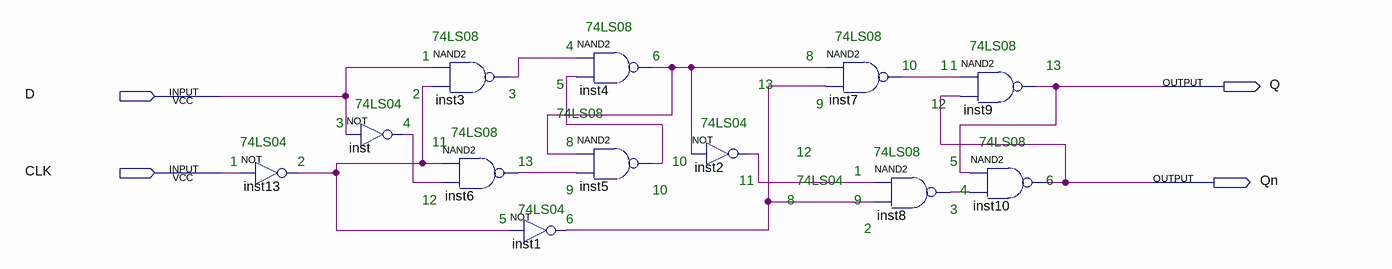
[diagram p0: schematic sheet]
// Quartus schematic Ex7.bdf as structural Verilog: 12 symbols, 4 pins
module Ex7 (
  input  D,
  input  CLK,
  output Q,
  output Qn
);

  wire inst1_out, inst2_out, inst3_out, inst4_out, inst5_out, inst6_out, inst7_out, inst8_out, inst13_out,
       inst_out;

  not inst13 (inst13_out, CLK);
  not inst (inst_out, D);
  nand inst3 (inst3_out, D, inst13_out);
  nand inst6 (inst6_out, inst13_out, inst_out);
  nand inst4 (inst4_out, inst3_out, inst5_out);
  nand inst5 (inst5_out, inst4_out, inst6_out);
  not inst1 (inst1_out, inst13_out);
  not inst2 (inst2_out, inst4_out);
  nand inst7 (inst7_out, inst4_out, inst1_out);
  nand inst8 (inst8_out, inst2_out, inst1_out);
  nand inst9 (Q, inst7_out, Qn);
  nand inst10 (Qn, Q, inst8_out);

  // Notes on the sheet:
  //   74LS08
  //   74LS08
  //   74LS08
  //   4
  //   74LS08
  //   1
  //   6
  //   8
  //   10
  //   1
  //   1
  //   13
  //   5
  //   13
  //   2
  //   3
  //   74LS04
  //   9
  //   12
  //   74LS08
  //   3
  //   4
  //   74LS04
  //   74LS08
  //   74LS04
  //   11
  //   8
  //   74LS08
  //   12
  //   74LS08
  //   1
  //   2
  //   13
  //   10
  //   5
  //   1
  //   11
  //   74LS04
  //   6
  //   9
  //   10
  //   4
  //   12
  //   8
  //   9
  //   74LS04
  //   3
  //   5
  //   6
  //   2
endmodule
